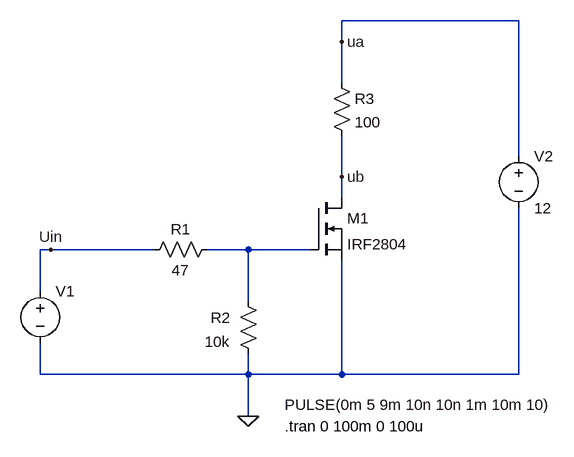
[diagram p0: schematic Draft4.asc]
Draft4.asc, the LTspice schematic file:
Version 4
SHEET 1 896 680
WIRE 800 -240 528 -240
WIRE 528 -208 528 -240
WIRE 528 -144 528 -208
WIRE 800 -32 800 -240
WIRE 528 0 528 -64
WIRE 528 32 528 0
WIRE 80 112 64 112
WIRE 240 112 80 112
WIRE 384 112 320 112
WIRE 480 112 384 112
WIRE 64 176 64 112
WIRE 384 192 384 112
WIRE 64 304 64 256
WIRE 384 304 384 272
WIRE 384 304 64 304
WIRE 528 304 528 128
WIRE 528 304 384 304
WIRE 800 304 800 48
WIRE 800 304 528 304
WIRE 384 368 384 304
FLAG 384 368 0
FLAG 528 -208 ua
FLAG 80 112 Uin
FLAG 528 0 ub
SYMBOL voltage 64 160 R0
WINDOW 3 376 191 Left 2
WINDOW 123 0 0 Left 0
WINDOW 39 0 0 Left 0
SYMATTR Value PULSE(0m 5 9m 10n 10n 1m 10m 10)
SYMATTR InstName V1
SYMBOL voltage 800 -48 R0
SYMATTR InstName V2
SYMATTR Value 12
SYMBOL res 336 96 R90
WINDOW 0 0 56 VBottom 2
WINDOW 3 32 56 VTop 2
SYMATTR InstName R1
SYMATTR Value 47
SYMBOL res 368 176 R0
WINDOW 0 -42 41 Left 2
WINDOW 3 -51 78 Left 2
SYMATTR InstName R2
SYMATTR Value 10k
SYMBOL res 512 -160 R0
SYMATTR InstName R3
SYMATTR Value 100
SYMBOL nmos 480 32 R0
SYMATTR InstName M1
SYMATTR Value IRF2804
TEXT 440 384 Left 2 !.tran 0 100m 0 100u

The netlist it stands for:
* Draft4.asc
V1 Uin 0 PULSE(0m 5 9m 10n 10n 1m 10m 10)
V2 ua 0 12
R1 N001 Uin 47
R2 N001 0 10k
R3 ua ub 100
M1 ub N001 0 0 IRF2804
.model NMOS NMOS
.model PMOS PMOS
.lib standard.mos
.tran 0 100m 0 100u
.backanno
.end

* Results of the author's LTspice run, read from the files saved beside the schematic
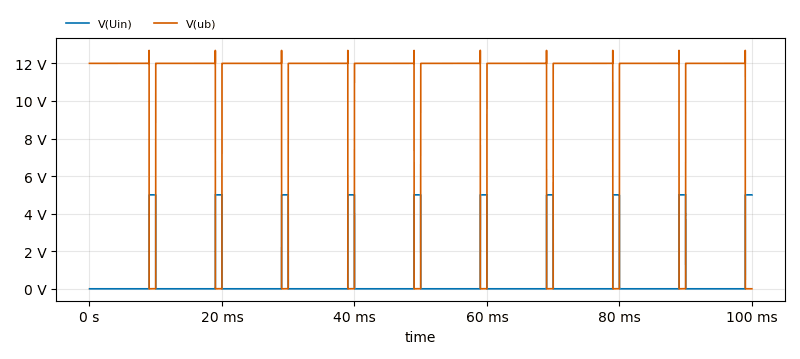
[diagram p1: Transient Analysis of Draft4.asc, plotted from the saved traces]
* Transient Analysis, 1 run:
*   V(Uin): min 0 V, max 5 V, average 500 mV, rms 1.581 V, last 5 V
*   V(ub): min 767.1 µV, max 12.69 V, average 10.8 V, rms 11.38 V, last 1.31 mV